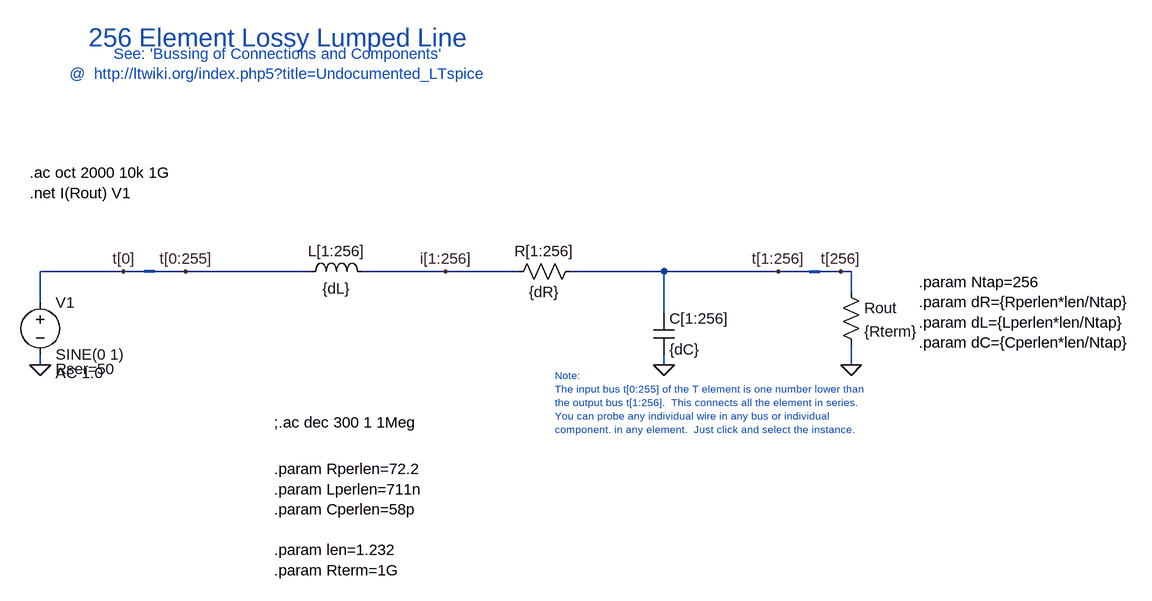
[diagram p0: schematic sparam_lumpedline256.asc]
sparam_lumpedline256.asc, the LTspice schematic file:
Version 4
SHEET 1 1668 680
WIRE -368 80 -496 80
WIRE -336 80 -368 80
WIRE -272 80 -320 80
WIRE -80 80 -272 80
WIRE 128 80 0 80
WIRE 240 80 128 80
WIRE 464 80 320 80
WIRE 640 80 464 80
WIRE 688 80 640 80
WIRE 736 80 704 80
WIRE 752 80 736 80
WIRE 752 112 752 80
WIRE -496 128 -496 80
WIRE 464 144 464 80
WIRE -496 224 -496 208
WIRE 464 224 464 208
WIRE 752 224 752 192
FLAG -496 224 0
FLAG 464 224 0
FLAG -272 80 t[0:255]
FLAG 640 80 t[1:256]
FLAG -368 80 t[0]
FLAG 736 80 t[256]
FLAG 752 224 0
FLAG 128 80 i[1:256]
BUSTAP -320 80 -336 80
BUSTAP 688 80 704 80
SYMBOL res 336 64 R90
WINDOW 0 0 56 VBottom 2
WINDOW 3 32 56 VTop 2
SYMATTR InstName R[1:256]
SYMATTR Value {dR}
SYMBOL cap 448 144 R0
SYMATTR InstName C[1:256]
SYMATTR Value {dC}
SYMATTR SpiceLine Rser=0
SYMBOL ind 16 96 M270
WINDOW 0 32 56 VTop 2
WINDOW 3 5 56 VBottom 2
SYMATTR InstName L[1:256]
SYMATTR Value {dL}
SYMATTR SpiceLine Rser=0
SYMBOL res 736 96 R0
SYMATTR InstName Rout
SYMATTR Value {Rterm}
SYMBOL voltage -496 112 R0
WINDOW 39 24 118 Left 2
WINDOW 123 24 124 Left 2
SYMATTR SpiceLine Rser=50
SYMATTR InstName V1
SYMATTR Value SINE(0 1)
SYMATTR Value2 AC 1.0
TEXT -136 312 Left 2 !;.ac dec 300 1 1Meg
TEXT -128 -280 Center 4 ;256 Element Lossy Lumped Line
TEXT -128 -240 Center 2 ;See: 'Bussing of Connections and Components'\n@  http://ltwiki.org/index.php5?title=Undocumented_LTspice
TEXT 296 240 Left 1 ;Note: \nThe input bus t[0:255] of the T element is one number lower than \nthe output bus t[1:256].  This connects all the element in series.\nYou can probe any individual wire in any bus or individual \ncomponent. in any element.  Just click and select the instance.
TEXT -136 384 Left 2 !.param Rperlen=72.2\n.param Lperlen=711n\n.param Cperlen=58p\n\n.param len=1.232\n.param Rterm=1G
TEXT 856 96 Left 2 !.param Ntap=256\n.param dR={Rperlen*len/Ntap}\n.param dL={Lperlen*len/Ntap}\n.param dC={Cperlen*len/Ntap}
TEXT -512 -72 Left 2 !.ac oct 2000 10k 1G\n.net I(Rout) V1

The netlist it stands for:
* sparam_lumpedline256.asc
R[1:256] t[1:256] i[1:256] {dR}
C[1:256] t[1:256] 0 {dC} Rser=0
L[1:256] i[1:256] t[0:255] {dL} Rser=0
Rout t[256] 0 {Rterm}
V1 t[0] 0 SINE(0 1) AC 1.0 Rser=50
;.ac dec 300 1 1Meg
* 256 Element Lossy Lumped Line
* See: 'Bussing of Connections and Components'
* @  http://ltwiki.org/index.php5?title=Undocumented_LTspice
* Note:
* The input bus t[0:255] of the T element is one number lower than
* the output bus t[1:256].  This connects all the element in series.
* You can probe any individual wire in any bus or individual
* component. in any element.  Just click and select the instance.
.param Rperlen=72.2
.param Lperlen=711n
.param Cperlen=58p
.param len=1.232
.param Rterm=1G
.param Ntap=256
.param dR={Rperlen*len/Ntap}
.param dL={Lperlen*len/Ntap}
.param dC={Cperlen*len/Ntap}
.ac oct 2000 10k 1G
.net I(Rout) V1
.backanno
.end